# EAGLE design jn5169_v1 (EAGLE 9.6.2)
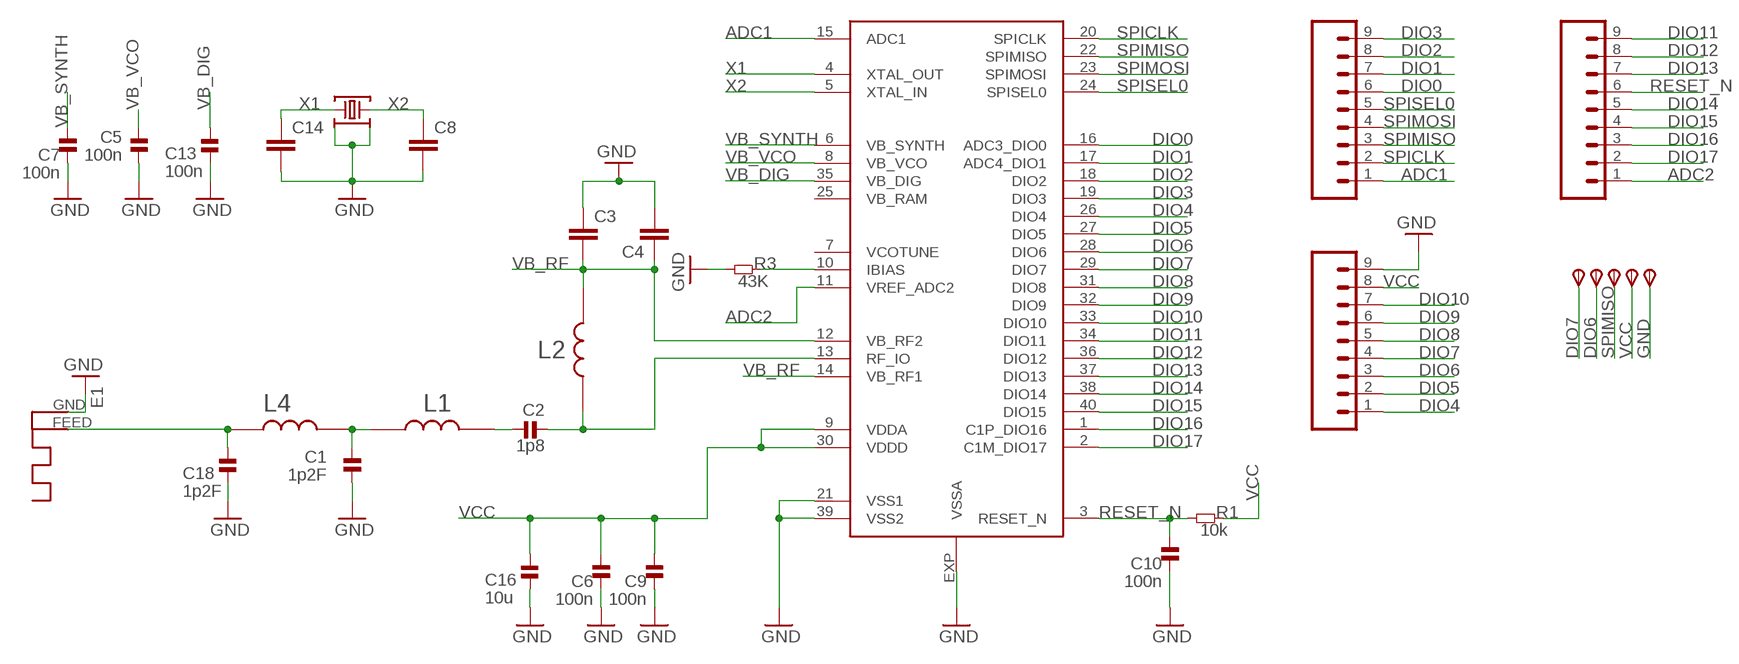
[diagram p0: schematic, sheet 1]

## Parts
C1  1p2F  CAP-0402  [_PKG_C_0402]
C2  1p8  CAP-0402  [_PKG_C_0402]
C3  100n  CAP0402  [CAPC1005X40N]
C4  47pf  CAP0402  [CAPC1005X40N]
C5  100n  CAP-0402  [_PKG_C_0402]
C6  100n  CAP-0402  [_PKG_C_0402]
C7  100n  CAP-0402  [_PKG_C_0402]
C8  12p  CAP0402  [CAPC1005X40N]
C9  100n  CAP-0402  [_PKG_C_0402]
C10  100n  CAP-0402  [_PKG_C_0402]
C13  100n  CAP-0402  [_PKG_C_0402]
C14  12p  CAP0402  [CAPC1005X40N]
C16  10u  CAP-0805  [_PKG_C_0805]
C18  1p2F  CAP-0402  [_PKG_C_0402]
E1  ANTENNA  [RN-ANT]
GND  TPSTP11R  [TP11R]
J1  CONN_051.27MM  [1X05_1.27MM]
J2  CONN_051.27MM  [1X05_1.27MM]
J3  CONN_051.27MM  [1X05_1.27MM]
L1  3n3H  IND0402IND0402  [INDC1005X40N]
L2  1n5H  IND0402IND0402  [INDC1005X40N]
L4  2n7H  IND0402IND0402  [INDC1005X40N]
R1  10k  RES-0402  [_PKG_C_0402]
R3  43K  RES-0402  [_PKG_C_0402]
RX  TPSTP11R  [TP11R]
TDO  TPSTP11R  [TP11R]
TX  TPSTP11R  [TP11R]
U$1  JN5168/A02Z  [QFN50P600X600X100-41N]
VCC  TPSTP11R  [TP11R]
Y1  32MHZ  48.000MHZ_CX2016DB48000C0FPLC1  [XTAL-4P-2016]

## Nets
ADC1: J1.1 U$1.15(ADC1)
ADC2: J3.1 U$1.11(VREF_ADC2)
DIO0: J1.6 U$1.16(ADC3_DIO0)
DIO1: J1.7 U$1.17(ADC4_DIO1)
DIO2: J1.8 U$1.18(DIO2)
DIO3: J1.9 U$1.19(DIO3)
DIO4: J2.1 U$1.26(DIO4)
DIO5: J2.2 U$1.27(DIO5)
DIO6: J2.3 TX.TP(PP) U$1.28(DIO6)
DIO7: J2.4 RX.TP(PP) U$1.29(DIO7)
DIO8: J2.5 U$1.31(DIO8)
DIO9: J2.6 U$1.32(DIO9)
DIO10: J2.7 U$1.33(DIO10)
DIO11: J3.9 U$1.34(DIO11)
DIO12: J3.8 U$1.36(DIO12)
DIO13: J3.7 U$1.37(DIO13)
DIO14: J3.5 U$1.38(DIO14)
DIO15: J3.4 U$1.40(DIO15)
DIO16: J3.3 U$1.1(C1P_DIO16)
DIO17: J3.2 U$1.2(C1M_DIO17)
GND: C1.1 C3.1 C4.2 C5.1 C6.1 C7.1 C8.2 C9.1 C10.1 C13.2 C14.2 C16.2 C18.2 E1.GND GND.TP(PP) J2.9 R3.2 U$1.21(VSS1) U$1.39(VSS2) U$1.EXP(VSSA) Y1.2 Y1.4
N$1: C2.2 L1.2
N$2: C2.1 L2.1 U$1.13(RF_IO)
N$3: C1.2 L1.1 L4.2
N$4: C18.1 E1.FEED L4.1
N$5: R3.1 U$1.10(IBIAS)
RESET_N: C10.2 J3.6 R1.2 U$1.3(RESET_N)
SPICLK: J1.2 U$1.20(SPICLK)
SPIMISO: J1.3 TDO.TP(PP) U$1.22(SPIMISO)
SPIMOSI: J1.4 U$1.23(SPIMOSI)
SPISEL0: J1.5 U$1.24(SPISEL0)
VB_DIG: C13.1 U$1.35(VB_DIG)
VB_RF: C3.2 C4.1 L2.2 U$1.12(VB_RF2) U$1.14(VB_RF1)
VB_SYNTH: C7.2 U$1.6(VB_SYNTH)
VB_VCO: C5.2 U$1.8(VB_VCO)
VCC: C6.2 C9.2 C16.1 J2.8 R1.1 U$1.9(VDDA) U$1.30(VDDD) VCC.TP(PP)
X1: C14.1 U$1.4(XTAL_OUT) Y1.1
X2: C8.1 U$1.5(XTAL_IN) Y1.3

## Power pins joined to a net without a drawn wire
VB_RAM: U$1.25(VB_RAM)
VCOTUNE: U$1.7(VCOTUNE)

## Library data of the parts
C1 C2 C5-C7 C9 C10 C13 C16 C18 = ok-discretes-dev:CAP
C3 C4 C8 C14 = discretes-dev:CAP0402: CAP, 0402; AVAILABILITY: Good; DESCRIPTION: RESISTOR, 0402 0.063W 1% 3M6; Resistance:3.6Mohm; Resistance Tolerance:± 1%; Power Rating:0.063W; Voltage Rating:50V; Series:RC32H; Temperature Coefficient:± 100ppm/°C; Resistor Element Type:Thick Film; Resistor Case Style:0402; No. of Pins:2; SVHC:No SVHC; Case Style:0402; External Length / Height:1mm; Temperature Coeff. +:100ppm/°C; Temperature Coeff. -:100ppm/°C; External Depth:0.35mm; External Width:0.5mm; Operating Temperature Range:-55°C to +155°C; Overload Voltage:100V; MF: Yageo; MP: RC0402FR-073M6L; PACKAGE: 1005 Panasonic Electronic Components; PRICE: None; PURCHASE-URL: https://pricing.snapeda.com/search/part/RC0402FR-073M6L/?ref=eda
E1 = adafruit:ANTENNA
GND RX TDO TX VCC = testpad:TPS: TEST PIN
J1-J3 = SparkFun-Connectors:CONN_05: Multi connection point. Often used as Generic Header-pin footprint for 0.1 inch spaced/style header connections On any of the 0.1 inch spaced packages, you can populate with these: Break Away Headers - Straight <https://www.sparkfun.com/products/116> (PRT-00116) Break Away Male Headers - Right Angle <https://www.sparkfun.com/products/553> (PRT-00553) Female Headers <https://www.sparkfun.com/products/115> (PRT-00115) Break Away Headers - Machine Pin <https://www.sparkfun.com/products/117> (PRT-00117) Break Away Female Headers - Swiss Machine Pin <https://www.sparkfun.com/products/743> (PRT-00743) For SCREWTERMINALS and SPRING TERMINALS visit here: Screw Terimnals on SparkFun.com <https://www.sparkfun.com/search/results?term=Screw+Terminals> (5mm/3.5mm/2.54mm spacing) This device is also useful as a general connection point to wire up your design to another part of your project. Our various solder wires solder well into these plated through hole pads. Hook-Up Wire - Assortment (Stranded, 22 AWG) <https://www.sparkfun.com/products/11375> (PRT-11375) Hook-Up Wire - Assortment (Solid Core, 22 AWG) <https://www.sparkfun.com/products/11367> (PRT-11367) View the entire wire category on our website here <https://www.sparkfun.com/categories/141> Special notes: Molex polarized connector foot print use with SKU : PRT-08231 with associated crimp pins and housings. 1MM SMD Version SKU: PRT-10208
L1 L2 L4 = discretes-dev:IND0402: RESISTOR, 0402 0.063W 1% 3M6; Resistance:3.6Mohm; Resistance Tolerance:± 1%; Power Rating:0.063W; Voltage Rating:50V; Series:RC32H; Temperature Coefficient:± 100ppm/°C; Resistor Element Type:Thick Film; Resistor Case Style:0402; No. of Pins:2; SVHC:No SVHC; Case Style:0402; External Length / Height:1mm; Temperature Coeff. +:100ppm/°C; Temperature Coeff. -:100ppm/°C; External Depth:0.35mm; External Width:0.5mm; Operating Temperature Range:-55°C to +155°C; Overload Voltage:100V Check prices <https://pricing.snapeda.com/parts/RC0402FR-073M6L/Yageo/view-part?ref=eda>; AVAILABILITY: Good; DESCRIPTION: RESISTOR, 0402 0.063W 1% 3M6; Resistance:3.6Mohm; Resistance Tolerance:± 1%; Power Rating:0.063W; Voltage Rating:50V; Series:RC32H; Temperature Coefficient:± 100ppm/°C; Resistor Element Type:Thick Film; Resistor Case Style:0402; No. of Pins:2; SVHC:No SVHC; Case Style:0402; External Length / Height:1mm; Temperature Coeff. +:100ppm/°C; Temperature Coeff. -:100ppm/°C; External Depth:0.35mm; External Width:0.5mm; Operating Temperature Range:-55°C to +155°C; Overload Voltage:100V; MF: Yageo; MP: RC0402FR-073M6L; PACKAGE: 1005 Panasonic Electronic Components; PRICE: None; PURCHASE-URL: https://pricing.snapeda.com/search/part/RC0402FR-073M6L/?ref=eda
R1 R3 = ok-discretes-dev:RES
U$1 = JN5169_vqfn40:JN5168/A02Z: JN5168 - ZigBee, RF4CE, JenNet-IP and IEEE802.15.4 wireless microcontroller with 256 kB Flash, 32 kB RAM Check availability <https://pricing.snapeda.com/parts/JN5168/A02Z/NXP%20Semiconductors/view-part?ref=eda>; AVAILABILITY: Not in stock; DESCRIPTION: JN5168 - ZigBee, RF4CE, JenNet-IP and IEEE802.15.4 wireless microcontroller with 256 kB Flash, 32 kB RAM; MF: NXP Semiconductors; MP: JN5168/A02Z; PACKAGE: None; PRICE: None
Y1 = ok-xtal-osc-dev:48.000MHZ_CX2016DB48000C0FPLC1: 48MHz ±10ppm Crystal 7pF 50 Ohms 4-SMD, No Lead Datasheet <https://media.digikey.com/pdf/Data%20Sheets/Kyocera%20International/CX2016DB48000C0FPLC1_DS.pdf>; DIGIKEY_PART: 1253-2042-1-ND; MFG_NAME: KYOCERA; MFG_PART: CX2016DB48000C0FPLC1

## Board
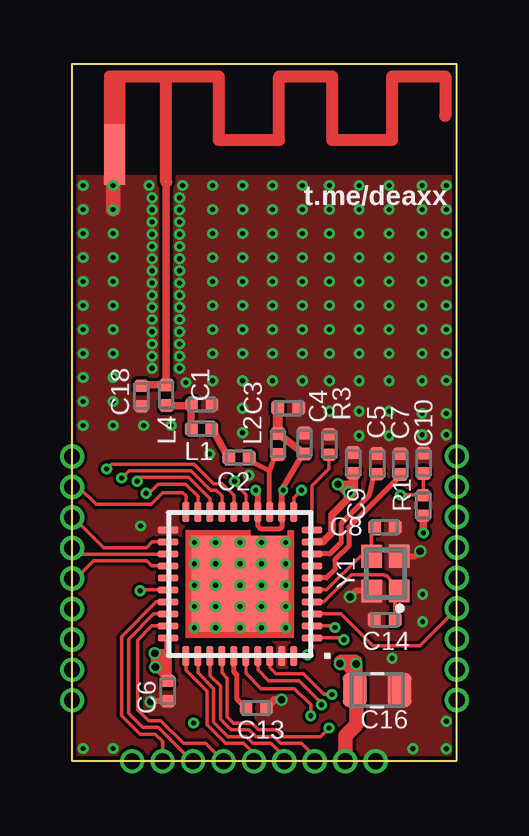
[diagram p1: board, top side]
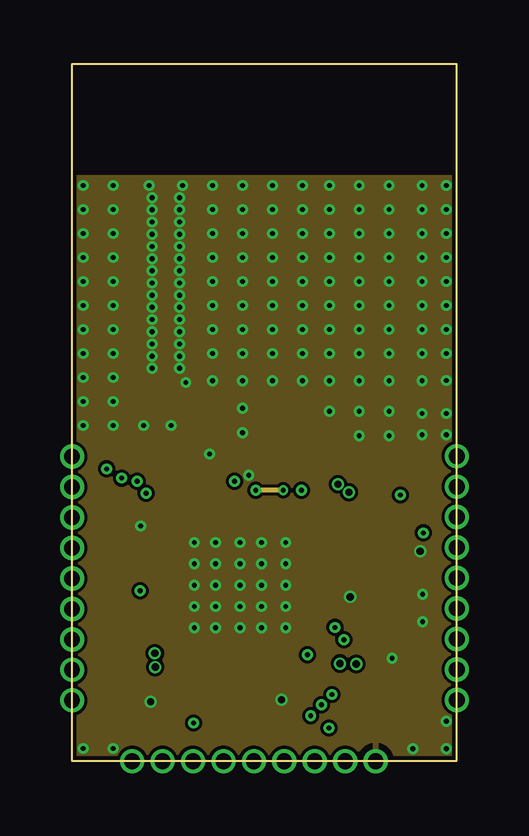
[diagram p2: board, inner layer Route2]
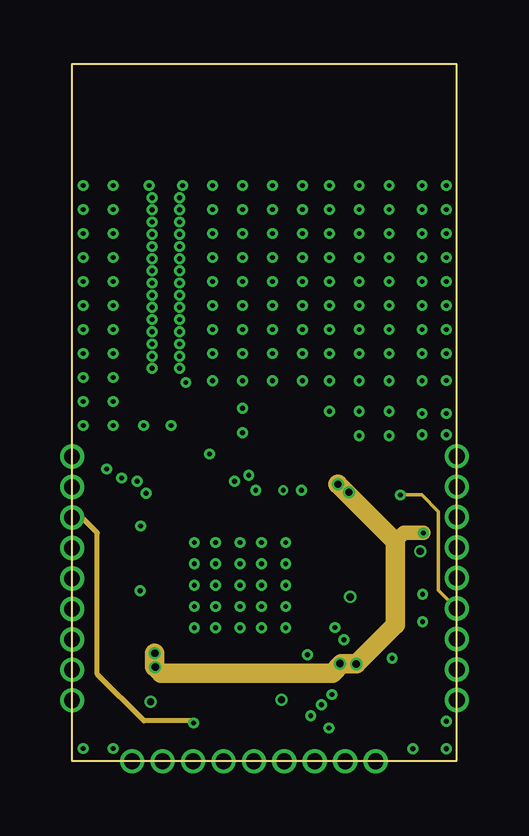
[diagram p3: board, inner layer Route15]
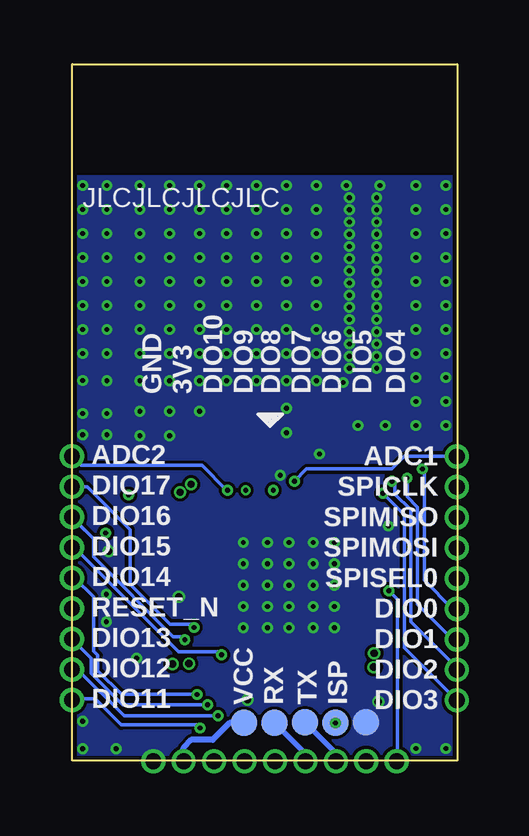
[diagram p4: board, bottom side, seen from below]

Size 16.05 x 29.02 mm. Coordinates in mm from the lower left corner, seen from the top.
Outline: 16.05,0 16.05,29.02 0,29.02 0,0 16.05,0
Copper layers (1*2*15*16): Top 0.035559375mm / dielectric 0.17018125mm / Route2 0.01778125mm / dielectric 0.4mm / Route15 0.01778125mm / dielectric 0.17018125mm / Bottom 0.035559375mm
Design rules "oshpark-4layer *": minimum track width 6mil, minimum drill 0.2mm, track to track 5mil, track to pad 5mil, pad to pad 5mil, via to via 5mil, smd to smd 5mil, copper to edge 0.16mm, drill to drill 0.2mm, minimum pad ring 4mil, minimum via ring 4mil, stop-mask expansion 2.5mil, vias tented up to drill 50mil, thermal gap 10mil

### Footprints (pad centres in the part's own frame; a part is rotated, then mirrored left to right if it is on the bottom)
_PKG_C_0402 = smd 0.54 x 0.6: 1 -0.43,0; 2 0.43,0
CAPC1005X40N = smd 0.54 x 0.6: 1 -0.432,0; 2 0.432,0
_PKG_C_0805 = smd 1 x 1.42: 1 -0.935,0; 2 0.935,0
RN-ANT = smd 0.025 x 0.025: FEED 0,2.159 | smd 2.54 x 0.889: GND -1.143,0
TP11R = smd 1.1 x 1.1: TP 0,0
1X05_1.27MM = drill 0.65 pad 1.016: 1 0,0; 2 1.27,0; 3 2.54,0; 4 3.81,0; 5 5.08,0; 6 6.35,0; 7 7.62,0; 8 8.89,0; 9 10.16,0
INDC1005X40N = smd 0.54 x 0.6: 1 -0.432,0; 2 0.432,0
QFN50P600X600X100-41N = smd 0.85 x 0.3: 1 -3,2.25; 2 -3,1.75; 3 -3,1.25; 4 -3,0.75; 5 -3,0.25; 6 -3,-0.25; 7 -3,-0.75; 8 -3,-1.25; 9 -3,-1.75; 10 -3,-2.25; 21 3,-2.25; 22 3,-1.75; 23 3,-1.25; 24 3,-0.75; 25 3,-0.25; 26 3,0.25; 27 3,0.75; 28 3,1.25; 29 3,1.75; 30 3,2.25 | smd 0.3 x 0.85: 11 -2.25,-3; 12 -1.75,-3; 13 -1.25,-3; 14 -0.75,-3; 15 -0.25,-3; 16 0.25,-3; 17 0.75,-3; 18 1.25,-3; 19 1.75,-3; 20 2.25,-3; 31 2.25,3; 32 1.75,3; 33 1.25,3; 34 0.75,3; 35 0.25,3; 36 -0.25,3; 37 -0.75,3; 38 -1.25,3; 39 -1.75,3; 40 -2.25,3 | smd 4 x 4: EXP 0.001,-0.013
XTAL-4P-2016 = smd 0.95 x 0.85: 1 -0.725,-0.575; 2 0.725,-0.575; 3 0.725,0.575; 4 -0.725,0.575

### Placement (x,y rotation side)
C1  5.42,14.84 180 top
C2  6.97,12.62 180 top
C3  9.02,14.7 180 top
C4  9.69,13.21 90 top
C5  12.74,12.37 270 top
C6  4.01,2.9 90 top
C7  13.7,12.35 270 top
C8  13.06,9.72 0 top
C9  11.73,12.41 270 top
C10  14.67,12.39 270 top
C13  7.69,2.19 0 top
C14  13.04,5.87 180 top
C16  12.73,2.93 0 top
C18  2.9,15.19 270 top
E1  1.78,24.11 270 top
GND  3.8,1.6 270 bottom
J1  0.01,12.67 270 top
J2  2.52,-0.03 0 top
J3  16.06,12.68 270 top
L1  5.41,13.82 0 top
L2  8.59,13.19 90 top
L4  3.95,15.23 270 top
R1  14.66,10.63 90 top
R3  10.74,13.17 90 top
RX  7.61,1.57 270 bottom
TDO  5.07,1.57 270 bottom
TX  6.34,1.59 270 bottom
U$1  7.01,7.36 180 top
VCC  8.9,1.58 270 bottom
Y1  13.08,7.8 90 top

### Tracks (layer width: path | path; a pad name or v marks a point on that pad's centre or on a via)
ADC1  (via drill 0.2 pad 0.45)
  Top 0.152: U$1.15 7.26,11.07 6.78,11.55 v6.78,11.65
  Bottom 0.152: v6.78,11.65 6.27,12.15 2.72,12.15 2.2,12.67 J1.1
ADC2  (via drill 0.2 pad 0.45)
  Top 0.152: U$1.11 9.26,10.95 v9.58,11.26
  Bottom 0.152: J3.1 15.68,12.3 10.65,12.3 9.61,11.26 v9.58,11.26
DIO0  (via drill 0.2 pad 0.45)
  Top 0.152: U$1.16 6.76,11.05 6.26,11.54 5.91,11.54 5.1,12.36 1.65,12.36 v1.45,12.15
  Bottom 0.152: v1.45,12.15 1.37,12.08 1.37,7.51 0.19,6.32 J1.6
DIO1  (via drill 0.2 pad 0.45)
  Top 0.152: U$1.17 6.26,11.03 6.02,11.26 5.79,11.26 4.98,12.08 2.39,12.08 v2.08,11.77
  Bottom 0.152: v2.08,11.77 2.08,11 1.65,10.56 1.65,6.51 0.19,5.05 J1.7
DIO2  (via drill 0.2 pad 0.45)
  Top 0.152: U$1.18 5.76,10.9 4.87,11.8 2.87,11.8 v2.72,11.65
  Bottom 0.152: v2.72,11.65 2.59,11.52 2.59,11.11 1.93,10.45 1.93,5.78 0.01,3.86 J1.8
DIO3  (via drill 0.2 pad 0.45)
  Top 0.152: U$1.19 5.26,11.01 4.75,11.52 3.61,11.52 3.23,11.14 v3.1,11.14
  Bottom 0.152: v3.1,11.14 2.21,10.25 2.21,4.71 J1.9
DIO4  (via drill 0.2 pad 0.45)
  Top 0.152: U$1.26 2.88,7.11 v2.84,7.07
  Bottom 0.152: v2.84,7.07 2.49,6.72 2.49,0 J2.1
DIO5
  Top 0.152: J2.2 3.79,0.8 3.48,1.1 2.84,1.1 2.08,1.87 2.08,5.17 3.52,6.61 U$1.27
DIO6
  Top 0.152: U$1.28 3.42,6.11 2.36,5.05 2.36,1.98 2.96,1.38 3.6,1.38 5,-0.03 J2.3
  Bottom 0.2: TX.TP 5.06,0.31 J2.3
DIO7
  Top 0.152: U$1.29 3.34,5.61 2.75,5.02 2.75,2.12 3.2,1.66 3.71,1.66 4.65,0.72 5.58,0.72 J2.4
  Bottom 0.2: RX.TP 6.33,0.29 J2.4
DIO8
  Top 0.152: U$1.31 4.76,3.76 5.64,2.88 5.64,1.49 6.4,0.72 7.16,0.72 7.6,0.29 J2.5
DIO9
  Top 0.152: U$1.32 5.26,3.66 5.92,3 5.92,1.6 6.52,1 7.28,1 7.56,0.72 8.31,0.72 8.76,0.27 8.76,0.08 J2.6
DIO10
  Top 0.152: U$1.33 5.77,3.55 6.2,3.11 6.2,1.72 6.63,1.28 7.39,1.28 7.67,1 8.42,1 8.7,0.72 9.58,0.72 10.02,0.28 | 10.02,0.28 10.03,0.27 | J2.7 10.02,0.09 10.02,0.28
DIO11  (via drill 0.2 pad 0.45)
  Top 0.152: U$1.34 6.26,3.66 6.48,3.44 6.48,1.83 6.75,1.56 7.51,1.56 7.79,1.28 8.54,1.28 8.82,1 10.36,1 v10.72,1.36
  Bottom 0.152: v10.72,1.36 10.85,1.49 14,1.49 15.09,2.57 16.01,2.57 J3.9
DIO12  (via drill 0.2 pad 0.45)
  Top 0.152: U$1.36 7.26,3.63 7.89,3 9.29,3 9.96,2.33 v9.96,1.87
  Bottom 0.152: v9.96,1.87 v9.97,1.86 13.89,1.86 15.82,3.79 J3.8
DIO13  (via drill 0.2 pad 0.45)
  Top 0.152: U$1.37 7.76,3.78 8.21,3.33 9.47,3.33 10.41,2.4 v10.41,2.32
  Bottom 0.152: v10.41,2.32 13.95,2.32 15.27,3.63 15.27,4.27 J3.7
DIO14  (via drill 0.2 pad 0.45)
  Top 0.152: U$1.38 8.26,3.87 8.51,3.63 9.65,3.63 10.52,2.76 v10.85,2.76
  Bottom 0.152: v10.85,2.76 13.99,2.76 14.99,3.75 14.99,4.39 15.16,4.56 15.16,6.82 15.95,7.6 J3.5
DIO15  (via drill 0.2 pad 0.45)
  Top 0.152: U$1.40 9.78,4.36 v9.83,4.41
  Bottom 0.152: v9.83,4.41 9.96,4.53 11.61,4.53 15.78,8.7 15.89,8.7 J3.4
DIO16  (via drill 0.2 pad 0.45)
  Top 0.152: U$1.1 11.29,5.11 v11.35,5.04
  Bottom 0.152: v11.35,5.04 11.48,5.17 11.85,5.17 15.16,8.48 15.16,9.25 15.78,9.86 15.78,9.85 | 15.78,9.85 15.54,9.61 | J3.3 16.06,10.13 15.78,9.85
DIO17  (via drill 0.2 pad 0.45)
  Top 0.152: U$1.2 10.91,5.61 v10.97,5.55
  Bottom 0.152: v10.97,5.55 11.1,5.68 11.96,5.68 13.64,7.36 13.64,9.61 15.44,11.41 J3.2
GND  (via drill 0.2 pad 0.45, 0.3)
  Top 0.254: Y1.4 11.86,7.07 v11.61,6.82 | Y1.2 14.32,8.52 v14.53,8.72 | C6.1 3.31,2.47 v3.29,2.45
  Top 0.305: v8.75,2.54 8.46,2.54 8.12,2.2 C13.2
  Top 0.61: v1.73,22.96 1.73,24.45 1.78,24.51
  other vias: 3.35,16.34 3.35,16.85 3.35,17.36 3.35,17.87 3.35,18.38 3.35,18.88 3.35,19.39 3.35,19.9 3.35,20.41 3.35,20.92 3.35,21.42 3.35,21.93 3.35,22.44 3.35,22.95 3.35,23.46 3.23,23.96 4.5,16.34 4.5,16.85 4.5,17.36 4.5,17.87 4.5,18.38 4.5,18.88 4.5,19.39 4.5,19.9 4.5,20.41 4.5,20.92 4.5,21.42 4.5,21.93 4.5,22.44 4.5,22.95 4.5,23.46 4.62,23.96 1.73,23.96 0.48,23.96 0.48,22.96 0.48,21.96 0.48,20.96 0.48,19.96 0.48,18.96 0.48,17.96 0.48,16.96 1.73,21.96 1.73,20.96 1.73,19.96 1.73,18.96 1.73,17.96 1.73,16.96 5.87,23.96 7.12,23.96 8.37,23.96 9.62,23.96 10.74,23.96 11.99,23.96 13.23,23.96 14.61,23.96 5.87,22.96 5.87,21.96 5.87,20.96 5.87,19.96 5.87,18.96 5.87,17.96 5.87,16.96 7.12,22.96 7.12,21.96 7.12,20.96 7.12,19.96 7.12,18.96 7.12,17.96 7.12,16.96 8.37,22.96 8.37,21.96 8.37,20.96 8.37,19.96 8.37,18.96 8.37,17.96 8.37,16.96 9.62,22.96 9.62,21.96 9.62,20.96 9.62,19.96 9.62,18.96 9.62,17.96 9.62,16.96 10.74,22.96 10.74,21.96 10.74,20.96 10.74,19.96 10.74,18.96 10.74,17.96 10.74,16.96 11.99,22.96 11.99,21.96 11.99,20.96 11.99,19.96 11.99,18.96 11.99,17.96 11.99,16.96 13.23,22.96 13.23,21.96 13.23,20.96 13.23,19.96 13.23,18.96 13.23,17.96 13.23,16.96 14.61,22.96 14.61,21.96 14.61,20.96 14.61,19.96 14.61,18.96 14.61,17.96 14.61,16.96 15.62,15.84 15.62,14.46 0.48,15.96 0.48,14.96 0.48,13.96 1.73,15.96 1.73,14.96 1.73,13.96 15.62,16.96 15.62,17.96 15.62,18.96 15.62,19.96 15.62,20.96 15.62,21.96 15.62,22.96 15.62,23.96 7.02,7.31 6,7.31 5.11,7.31 7.9,7.31 8.92,7.31 7.9,6.42 7.9,5.53 8.92,6.42 8.92,5.53 7.02,6.42 7.02,5.53 6,5.53 6,6.42 5.11,5.53 5.11,6.42 5.11,8.2 5.11,9.09 6,8.2 6,9.09 7.02,8.2 7.9,8.2 8.92,8.2 7.02,9.09 8.92,9.09 7.9,9.09 7.12,15.82 7.12,14.68 7.12,13.66 8.37,15.82 9.62,15.82 10.74,15.82 11.99,15.82 13.23,15.82 14.61,15.82 13.23,14.55 11.99,14.55 10.74,14.55 14.61,14.46 5.87,15.82 3,13.96 4.14,13.96 0.48,0.5 1.73,0.5 15.62,0.49 15.62,1.64 14.23,0.49 13.36,4.26 2.87,9.77 5.75,12.77 7.38,11.88 4.75,15.75 11.99,13.54 13.23,13.54 14.61,13.58 15.62,13.58 14.63,5.79 14.63,6.93
  pour Top (no thermals): -0.14,-0.06 16.26,-0.06 16.26,24.32 -0.14,24.32
  pour Route2: -0.03,24.33 -0.03,-0.19 16.13,-0.19 16.13,24.33
  pour Bottom (no thermals): -0.03,-0.19 16.33,-0.19 16.33,24.32 -0.03,24.32
N$1
  Top 0.305: C2.2 L1.2
N$2
  Top 0.2: 8.23,10.38 U$1.13 | U$1.13 | 7.4,12.52 C2.1 7.4,12.5 8.25,12.08 | 8.57,12.76 L2.1 8.43,12.59 8.33,12.3 8.25,12.08 | U$1.13 8.25,12.08
  Top 0.305: 8.58,12.75 L2.1
N$3
  Top 0.305: L1.1 4.98,14.83 C1.2 4.94,14.79 L4.2
N$4
  Top 0.305: E1.FEED L4.1 2.94,15.66 C18.1
N$5
  Top 0.152: U$1.10 10.01,11.44 10.72,12.15 10.72,12.72 R3.1
RESET_N  (via drill 0.2 pad 0.45)
  Top 0.152: J3.6 14.51,4.79 12.55,4.79 11.23,6.11 U$1.3 | C10.2 14.66,11.95 R1.2 v13.7,11.07
  Route15 0.152: J3.6 15.29,7.1 15.29,10.38 14.6,11.07 v13.7,11.07
SPICLK
  Top 0.152: U$1.20 4.76,11.03 4.62,11.16 3.79,11.16 3.3,10.67 1,10.67 0.27,11.4 J1.2
SPIMISO  (via drill 0.2 pad 0.45)
  Top 0.152: U$1.22 3.36,9.11 3.12,8.88 1.32,8.88 0.27,9.92 0.27,10.13 J1.3
  Route15 0.2: v5.08,1.57 5.08,1.66 3.01,1.66 1.07,3.6 1.07,9.49 0.42,10.13 J1.3
  Bottom 0.152: TDO.TP v5.07,1.57 v5.08,1.57
SPIMOSI
  Top 0.152: U$1.23 4,8.6 0.3,8.6 0.04,8.86 J1.4
SPISEL0
  Top 0.152: U$1.24 3.33,8.11 3.12,8.32 0.91,8.32 0.19,7.59 J1.5 0.27,7.59 0.29,7.58 0.43,7.58 0.42,7.59
VB_DIG
  Top 0.2: U$1.35 6.75,3.71 6.88,3.58 6.88,2.57 C13.1
VB_RF  (via drill 0.2, 0.2 pad 0.45)
  Top 0.2: U$1.12 8.76,9.74 8.66,9.65 7.9,9.65 7.76,9.78 U$1.14
  Top 0.254: 8.75,13.62 L2.2 | U$1.12 8.76,11.21 v8.81,11.26 8.81,11.39 9.52,12.6 C4.1 | U$1.14 7.76,11.18 v7.67,11.26
  Top 0.305: C3.2 | C4.1 L2.2
  Top 0.406: L2.2 C3.2
  Route2 0.2: v8.81,11.26 v7.67,11.26
VB_SYNTH
  Top 0.2: C7.2 13.7,11.88 11.55,9.73 11.55,8.94 10.97,8.36 10.97,7.96 10.62,7.61 U$1.6
VB_VCO
  Top 0.2: U$1.8 10.76,8.61 11.22,9.08 11.22,9.87 12.38,11.03 12.56,11.76 C5.2
VCC  (via drill 0.2 pad 0.45, 0.3)
  Top 0.254: U$1.30 4.01,4.49 4.01,4.24 4.01,3.9 | 4.01,3.9 4.01,3.63 3.74,3.63 | 4.01,3.53 C6.2 | 3.74,3.63 3.49,3.9 v3.48,3.9 3.85,3.9 | 3.74,3.63 4.01,3.34 C6.2 | 3.85,3.9 4.01,3.9 | C6.2 3.85,3.9 | 11.22,11.39 11.59,11.39 11.53,11.34 11.36,11.52 v11.1,11.52 | 11.73,11.47 11.73,11.46 11.71,11.46 | 11.53,11.19 11.66,11.06 | 11.7,11.42 11.7,11.5 | 11.62,11.03
  Top 0.305: 11.71,11.54 11.71,11.95 C9.2 11.78,12.03 11.78,11.19 11.62,11.03 | 11.71,11.54 11.71,11.46 11.71,11.43 | U$1.9 10.47,9.11 10.85,9.49 10.85,10.25 11.49,10.89 | 11.66,11.06 11.62,11.03 | 11.62,11.03 11.49,10.89 | R1.1 v14.66,9.49 | v11.1,11.52 11.22,11.39 | v11.1,11.52 11.49,11.13 11.49,10.89 | 11.71,11.54 11.69,11.52 v11.1,11.52 | 11.53,11.34 11.53,11.19 | 11.71,11.43 11.7,11.42 | v11.56,11.18 11.71,11.33 11.71,11.43 | v3.48,3.9 3.46,3.92 3.46,4.21 | 3.46,4.21 v3.46,4.47 3.48,4.49 3.63,4.49 | 3.63,4.49 3.7,4.49 | 3.7,4.49 4.01,4.49 | U$1.30 4.01,4.24 | 4.01,4.24 4.01,3.66 | 4.01,3.66 4.01,3.63 4.01,3.53 | 4.01,3.66 3.54,4.13 | 3.54,4.13 3.46,4.21 | 3.54,4.13 3.89,4.13 4.01,4.24 | 4.01,4.24 3.95,4.24 3.79,4.4 | 3.79,4.4 3.7,4.49 | 3.79,4.4 3.72,4.4 3.63,4.49
  Top 0.508: 11.8,3.42 11.86,3.48 v11.86,4.03 11.86,4.16 11.19,4.16 v11.19,4.04 11.22,4.01 11.42,4.01 11.8,3.64 C16.1
  Top 0.61: J2.8 11.41,1.03 11.86,1.49 11.86,2.87 C16.1 11.8,3.42
  Route15 0.61: v14.66,9.49 13.85,9.49 13.49,9.13
  Route15 0.813: v11.1,11.52 13.49,9.13 13.49,5.65 v11.86,4.03 11.25,4.03 10.87,3.64 3.73,3.64 v3.48,3.9 3.46,3.92 v3.46,4.47
  Bottom 0.254: VCC.TP 9.49,1.58 10.2,0.86 11.09,0.86 11.41,0.54 J2.8
X1
  Top 0.152: U$1.4 10.52,6.61 11.66,7.75 13.01,7.75 13.05,7.71 13.13,7.71 Y1.1 13.47,6.89 C14.1
X2
  Top 0.152: 10.04,7.07 U$1.5 10.63,7.11 12.04,8.52 Y1.3 | 12.44,8.58 Y1.3 | Y1.3 12.5,9.6 C8.1

### Text on the board
tNames: t.me/deaxx | .
bNames: JLCJLCJLCJLC | DIO4 | DIO5 | DIO6 | DIO7 | DIO8 | DIO9 | DIO10 | 3V3 | GND | ADC1 | SPICLK | ADC2 | SPIMISO | DIO17 | DIO16 | SPIMOSI | DIO15 | SPISEL0 | DIO0 | DIO14 | DIO1 | RESET_N | DIO13 | DIO2 | DIO12 | DIO3 | ISP | TX | RX | VCC | DIO11